# Altium schematic sheet mc_ds.SchDoc
size A4
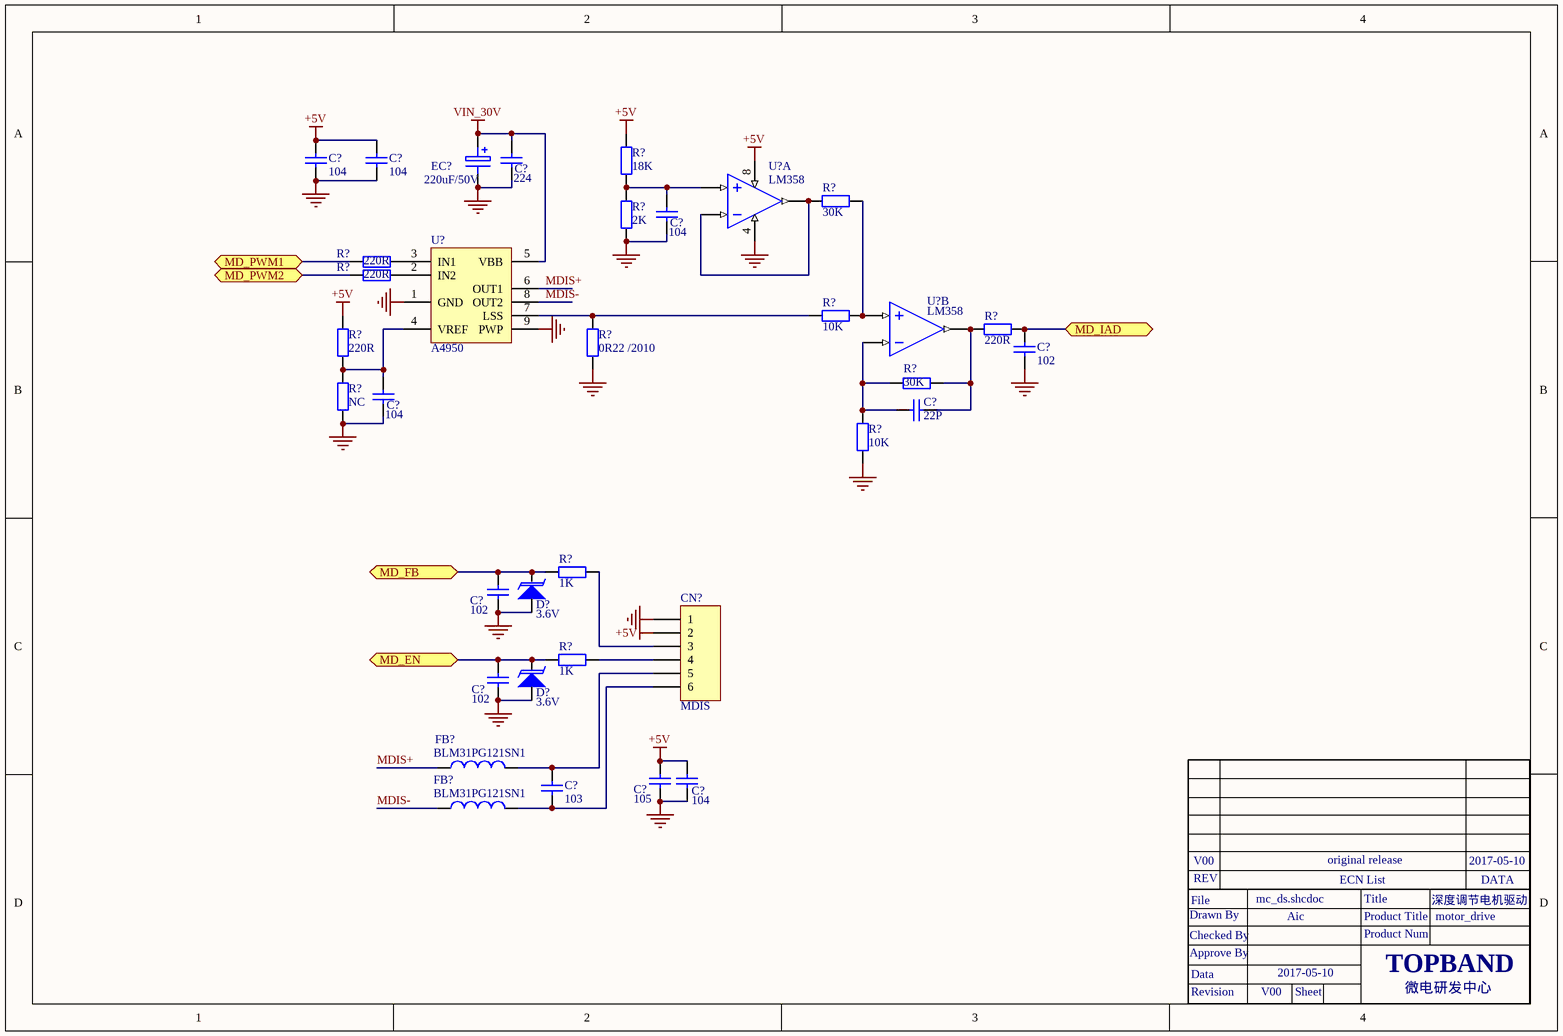
[diagram p0: mc_ds.SchDoc]

## Parts
(Parts that share a designator on the sheet are numbered #1, #2 ... from top to bottom, then left to right.)
C?#1  104  [0603C]
C?#2  104  [0603C]
C?#3  224  [0603C]
C?#4  104  [0603C]
C?#5  102  [0603C]
C?#6  22P  [0603C]
C?#7  104  [0603C]
C?#8  102  [0805C]
C?#9  102  [0805C]
C?#10  105  [0805C]
C?#11  104  [0603C]
C?#12  103  [0805C]
CN?  MDIS  [HDR1X6]
D?#1  3.6V  [SOD-123]
D?#2  3.6V  [SOD-123]
EC?  220uF/50V  [EC8]
FB?#1  BLM31PG121SN1  [1206R]
FB?#2  BLM31PG121SN1  [1206R]
R?#1  18K  [0603R]
R?#2  30K  [0603R]
R?#3  2K  [0603R]
R?#4  220R  [0603R]
R?#5  220R  [0603R]
R?#6  10K  [0603R]
R?#7  220R  [0603R]
R?#8  220R  [0603R]
R?#9  0R22 /2010  [2010R]
R?#10  30K  [0603R]
R?#11  NC  [0603R]
R?#12  10K  [0603R]
R?#13  1K  [0603R]
R?#14  1K  [0603R]
U?#1  LM358  [SO-8]  (part A of 2)
U?#2  A4950  [SO-8 - E]
U?#3  LM358  [SO-8]  (part B of 2)

## Ports
MD_EN, MD_FB, MD_IAD, MD_PWM1, MD_PWM2

## Nets
+5V: C?#1.2 C?#2.2 C?#10.1 C?#11.1 CN?.2 R?#1.2 R?#8.1 U?#1.8(VCC)
GND: C?#1.1 C?#2.1 C?#3.1 C?#4.1 C?#5.2 C?#7.1 C?#8.2 C?#9.2 C?#10.2 C?#11.2 CN?.1 D?#1.A D?#2.A EC?.2 R?#3.1 R?#9.2 R?#11.1 R?#12.1 U?#1.4(GND) U?#2.1(GND) U?#2.9(PWP)
VIN_30V: C?#3.2 EC?.1 U?#2.5(VBB)
MD_EN: C?#9.1 D?#2.K R?#14.2 ; port MD_EN
MD_FB: C?#8.1 D?#1.K R?#13.2 ; port MD_FB
MD_IAD: C?#5.1 R?#7.2 ; port MD_IAD
MD_PWM1: R?#4.1 ; port MD_PWM1
MD_PWM2: R?#5.1 ; port MD_PWM2
MDIS+: FB?#1.1 U?#2.6(OUT1)
MDIS-: FB?#2.1 U?#2.8(OUT2)
NetC?#4_2: C?#4.2 R?#1.1 R?#3.2 U?#1.5(+IN1)
NetC?#6_1: C?#6.1 R?#7.1 R?#10.1 U?#3.1(OUT2)
NetC?#6_2: C?#6.2 R?#10.2 R?#12.2 U?#3.2(-IN2)
NetC?#7_2: C?#7.2 R?#8.2 R?#11.2 U?#2.4(VREF)
NetC?#12_1: C?#12.1 CN?.5 FB?#1.2
NetC?#12_2: C?#12.2 CN?.6 FB?#2.2
NetCN?_3: CN?.3 R?#13.1
NetCN?_4: CN?.4 R?#14.1
NetR?#2_1: R?#2.1 U?#1.6(-IN1) U?#1.7(OUT1)
NetR?#2_2: R?#2.2 R?#6.2 U?#3.3(IN2+)
NetR?#4_2: R?#4.2 U?#2.3(IN1)
NetR?#5_2: R?#5.2 U?#2.2(IN2)
NetR?#6_1: R?#6.1 R?#9.1 U?#2.7(LSS)

## Notes on the sheet
- Drawn By
- File
- REV
- V00
- mc_ds.shcdoc
- Aic
- original release
- ECN List
- Product Title
- Title
- 深度调节电机驱动
- motor_drive
- 2017-05-10
- DATA
- Approve By
- Checked By
- Data
- Product Num
- TOPBAND
- Revision
- Sheet
- 微电研发中心

## Library data of the parts
C?#1-C?#12 = Cap(0603): Component Kind: standard; Component Type: standard
CN? = Header 6: Header, 6-Pin; LatestRevisionDate: 17-Jul-2002; LatestRevisionNote: Re-released for DXP Platform.; Publisher: Altium Limited
D?#1 D?#2 = Diode(TVS_贴片)_1: TVS管; U_TABLE: U_SAM010203; id: 28; Part Number: Diode(TVS_贴片)_1; Component Kind: standard; Component Type: standard; Pin Count: 2
EC? = Electro(2.5mm): 电解电容; U_TABLE: U_SAM010202; id: 42; Part Number: Electro(2.5mm); Component Kind: standard; Component Type: standard; Pin Count: 2
FB?#1 FB?#2 = Inductor: 电感; U_TABLE: U_SAM010207; id: 53; Part Number: Inductor; Component Kind: Standard; Component Type: Standard; Pin Count: 2
R?#1 R?#3 R?#13 R?#14 = Res2: Resistor; Published: 8-Jun-2000; LatestRevisionDate: 17-Jul-2002; LatestRevisionNote: Re-released for DXP Platform.; PackageReference: AXIAL-0.4; Publisher: Altium Limited
  R?#13 R?#14: Value: 1K
R?#2 R?#4-R?#8 R?#10-R?#12 = Res2: Resistor; Value: 1K; Published: 8-Jun-2000; LatestRevisionDate: 17-Jul-2002; LatestRevisionNote: Re-released for DXP Platform.; PackageReference: AXIAL-0.4; Publisher: Altium Limited
R?#9 = Res2: Resistor; Value: 1K; 物料编码: 150103083; Published: 8-Jun-2000; LatestRevisionDate: 17-Jul-2002; LatestRevisionNote: Re-released for DXP Platform.; PackageReference: AXIAL-0.4; Publisher: Altium Limited
U?#1 U?#3 = IC_LM358: 121000225; U_TABLE: U_SAM010210; Description: 集成电路; id: 83; U_ITEM_ID（物料编码）: 121000100; U_100114（SAP物料描述）: SMT运放LM358_SO-8_TI_环保; U_100047（环保属性）: 环保; U_100107（工厂BOM使用频率）: 1000:1;1500:12;3000:7;5000:14;; U_100105（工厂库存）: 1000:7508.000;1500:160.000;2000:0.000;3000:485.000;5000:1542.000;; U_100117（工厂采购量）: 1000:7500.000;1500:300.000;3000:2500.000;5000:7500.000;; Part Number: IC_LM358; Component Kind: standard; Component Type: standard; Designator: IC_LM358; Footprint: DIP14; Pin Count: 8; U_100076（型号）: LM358; U_100040（封装方式）: SO-8; U_100086（指定供应商）: TI